# Altium schematic sheet PowerSupply.SchDoc
size A4; Date: 27.05.2014; Author: REUSN5; DrawnBy: REUSN5; Organization: BFH; Address1: Berner Fachhochschule; Address2: Technik und Informatik; Address3: Jlcoweg 1; Address4: 3400 Burgdorf; DocumentNumber: 1; Revision: 1.0; SheetNumber: 6; SheetTotal: 6; CurrentDate: 27.05.2014
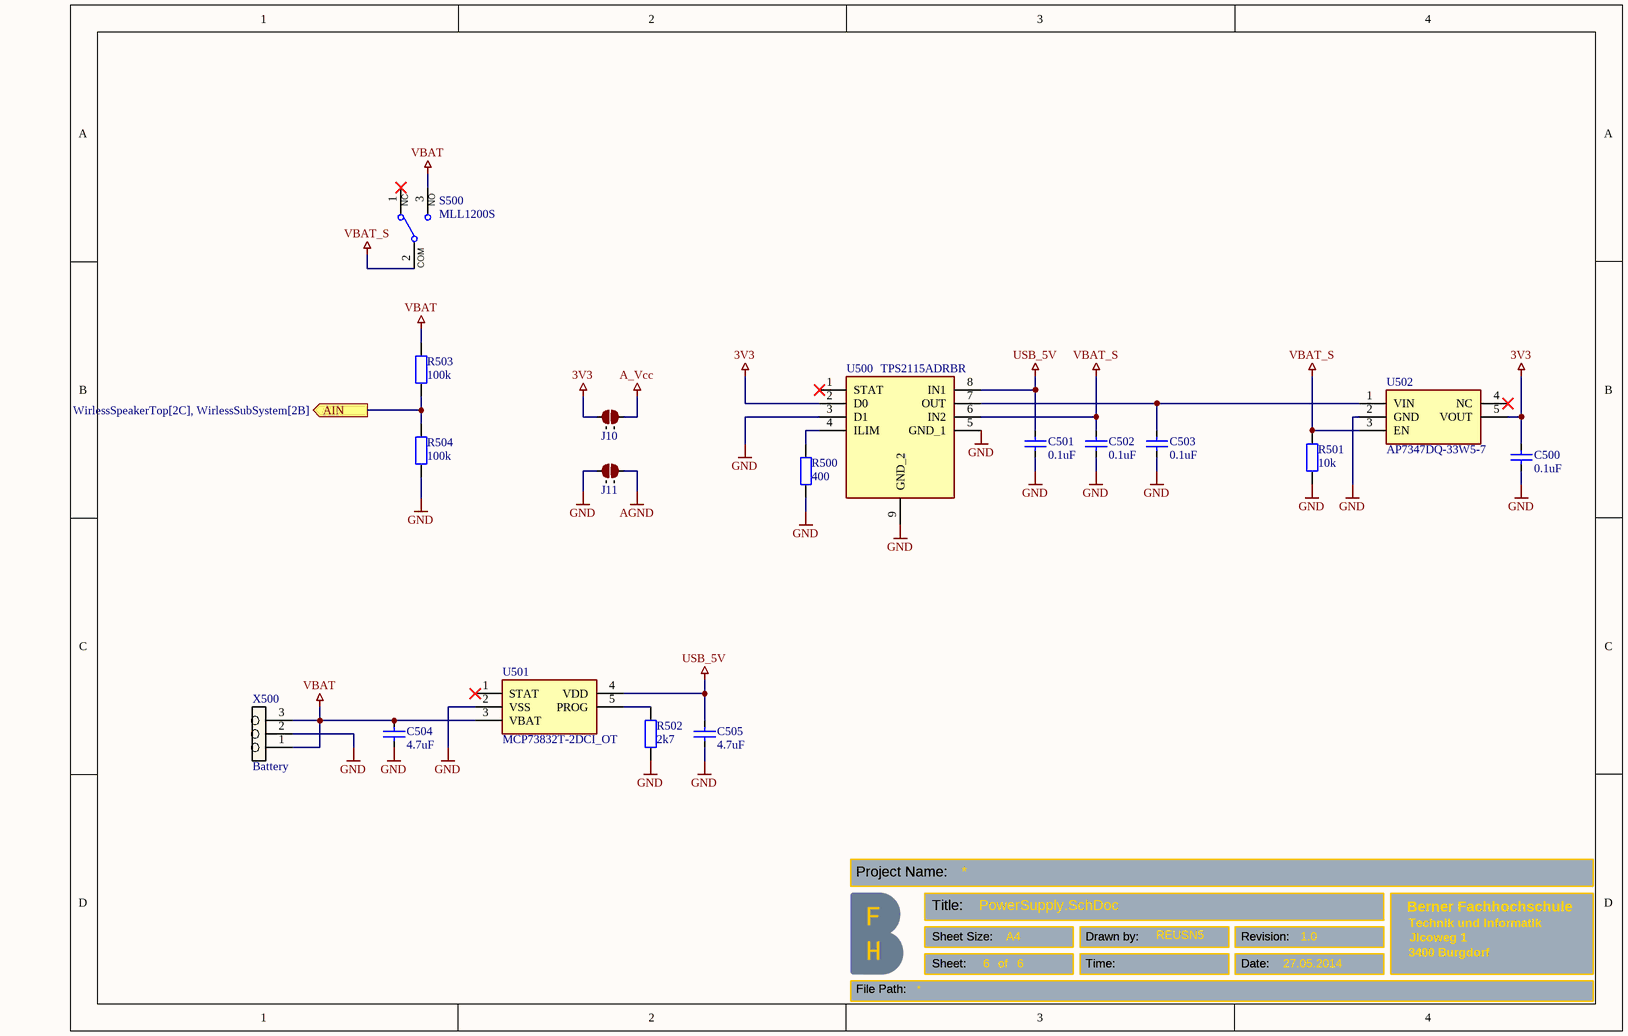
[diagram p0: PowerSupply.SchDoc]

## Parts
C500  0.1uF  [C-0603]
C501  0.1uF  [C-0603]
C502  0.1uF  [C-0603]
C503  0.1uF  [C-0603]
C504  4.7uF  [C-0603]
C505  4.7uF  [C-0603]
J10  2 way net solder junction - Normally Open  [2waySolder_NO]  (value not drawn)  (no BOM)
J11  2 way net solder junction - Normally Open  [2waySolder_NO]  (value not drawn)  (no BOM)
R500  400  [R-0603]
R501  10k  [R-0603]
R502  2k7  [R-0603]
R503  100k  [R-0603]
R504  100k  [R-0603]
S500  MLL1200S  [S-MLL1200S]
U500  TPS2115ADRBR  [SON65P300X300X100-9N-D]
U501  MCP73832T-2DCI_OT  [SOT-23-5]
U502  AP7347DQ-33W5-7  [SOT95P280X145-5N]
X500  Battery  [Battery]

## Ports
AIN (out, see WirlessSpeakerTop[2C], WirlessSubSystem[2B])

## Nets
3V3: C500.2 J10.1 U500.2(D0) U502.5(VOUT)
A_Vcc: J10.2
AGND: J11.2
GND: C500.1 C501.1 C502.1 C503.1 C504.1 C505.1 J11.1 R500.1 R501.1 R502.1 R504.1 U500.3(D1) U500.5(GND_1) U500.9(GND_2) U501.2(VSS) U502.2(GND) X500.2
USB_5V: C501.2 C505.2 U500.8(IN1) U501.4(VDD)
VBAT: C504.2 R503.2 S500.3(NO) U501.3(VBAT) X500.1 X500.3
VBAT_S: C502.2 R501.2 S500.2(Common) U500.6(IN2) U502.3(EN)
AIN: R503.1 R504.2 ; port AIN
NetC503_2: C503.2 U500.7(OUT) U502.1(VIN)
NetR500_2: R500.2 U500.4(ILIM)
NetR502_2: R502.2 U501.5(PROG)

Not connected (* = marked no-connect by the designer): S500 1(NC)*; U500 1(STAT)*; U501 1(STAT)*; U502 4(NC)*

## Notes on the sheet
- Project Name:
- Title:
- Sheet Size:
- Sheet:
- of
- A4
- Drawn by:
- Time:
- Revision:
- Date:
- File Path:
- (in symbol S-Slide-Switch) COM

## Library data of the parts
C500-C505 = C-SMD-0603: Multilayer Ceramic Capacitors MLCC; Manufacturer: Murata Electronics; Mfr. Part No.: GRM18...; Order-Code: 81-GRM18...; Price (CHF): 0.12; Distributor: Mouser; Added: 28.08.2018; ComponentLink1Description: Chip Multilayer Ceramic Capacitors; ComponentLink1URL: https://www.mouser.ch/datasheet/2/281/murata_03052018_GRM_Series_1-1310166.pdf; Notice: -; Mounting Style: SMD/SMT; Package: 0603
J10 J11 = 2waySolderNO: ComponentLink1URL: http://www.edatools.cz/addons; ComponentLink1Description: Source
R500-R504 = R-SMD-0603: Thin Film Resistors - SMD  0.1W  1%; Mfr. Part No.: MCU08050C*; Manufacturer: Vishay / Beyschlag; Order-Code: BFH-Lager; Price (CHF): 0.1; Distributor: Mouser; Notice: -; Added: 10.11.2012; Mounting Style: SMD/SMT; Package: 0603
S500 = S-Slide-Switch: Slide Switch SPDT RA SMT MLL1200S; Manufacturer: TE Connectivity; Order-Code: 506-MLL1200S; Distributor: Mouser; Price (CHF): 2.27; Added: 08.10.2018; Notice: -; Mounting Style: SMD/SMT; Package: SMD/SMT; Datasheet Link: https://www.te.com/commerce/DocumentDelivery/DDEController?Action=srchrtrv&DocNm=1437575-1&DocType=Customer+Drawing&DocLang=English&DocFormat=pdf&PartCntxt=1437575-1; Mfr. Part. Nr.: MLL1200S
U500 = TPS2115ADRBR: Power Supply; Manufacturer_Name: Texas Instruments; Datasheet Link: http://www.ti.com/lit/gpn/tps2115a; Height: 1mm; Manufacturer_Part_Number: TPS2115ADRBR; Mouser Part Number: 595-TPS2115ADRBR; Mouser Price/Stock: https://www.mouser.co.uk/ProductDetail/Texas-Instruments/TPS2115ADRBR?qs=g%2FrhRe7LVpSXEuLZV5FMOQ%3D%3D; Arrow Part Number: TPS2115ADRBR; Arrow Price/Stock: https://www.arrow.com/en/products/tps2115adrbr/texas-instruments?region=nac
U501 = MCP73832T-2DCI_OT: Integrated Circuit; Manufacturer_Name: Microchip; Manufacturer_Part_Number: MCP73832T-2DCI/OT; Datasheet Link: http://ww1.microchip.com/downloads/en/DeviceDoc/20001984g.pdf; Height: 1.45mm; Mouser Part Number: 579-MCP73832T-2DCIOT; Mouser Price/Stock: https://www.mouser.co.uk/ProductDetail/Microchip-Technology/MCP73832T-2DCI-OT?qs=yUQqVecv4quyMtCX903Btw%3D%3D; Arrow Part Number: MCP73832T-2DCI/OT; Arrow Price/Stock: https://www.arrow.com/en/products/mcp73832t-2dciot/microchip-technology?region=nac
U502 = AP7347DQ-33W5-7: Integrated Circuit; Manufacturer_Name: Diodes Inc.; Datasheet Link: https://ad.componentsearchengine.com/partRequest.html?fs=0&partNumber=AP7347DQ-33W5-7&partID=15420390&lang=null&packageCategoryID=54&C=1&W=1; Height: 1.45mm; Manufacturer_Part_Number: AP7347DQ-33W5-7; Mouser Part Number: 621-AP7347DQ-33W5-7; Mouser Price/Stock: https://www.mouser.co.uk/ProductDetail/Diodes-Incorporated/AP7347DQ-33W5-7?qs=XAiT9M5g4x%252B4DeOtxqD2uw%3D%3D; Arrow Part Number: AP7347DQ-33W5-7; Arrow Price/Stock: https://www.arrow.com/en/products/ap7347dq-33w5-7/diodes-incorporated?region=nac
X500 = X-Battery: Battery  connection pads; Value: Battery; Price (CHF): -; Order-Code: -; Manufacturer: -; Provider: -; Mfr. Part No.: -; Added: 10.08.2021; Mounting Style: Through Hole; Notice: -; Package: -